# EAGLE design ot3m_bt_smd (EAGLE 7.1.0)
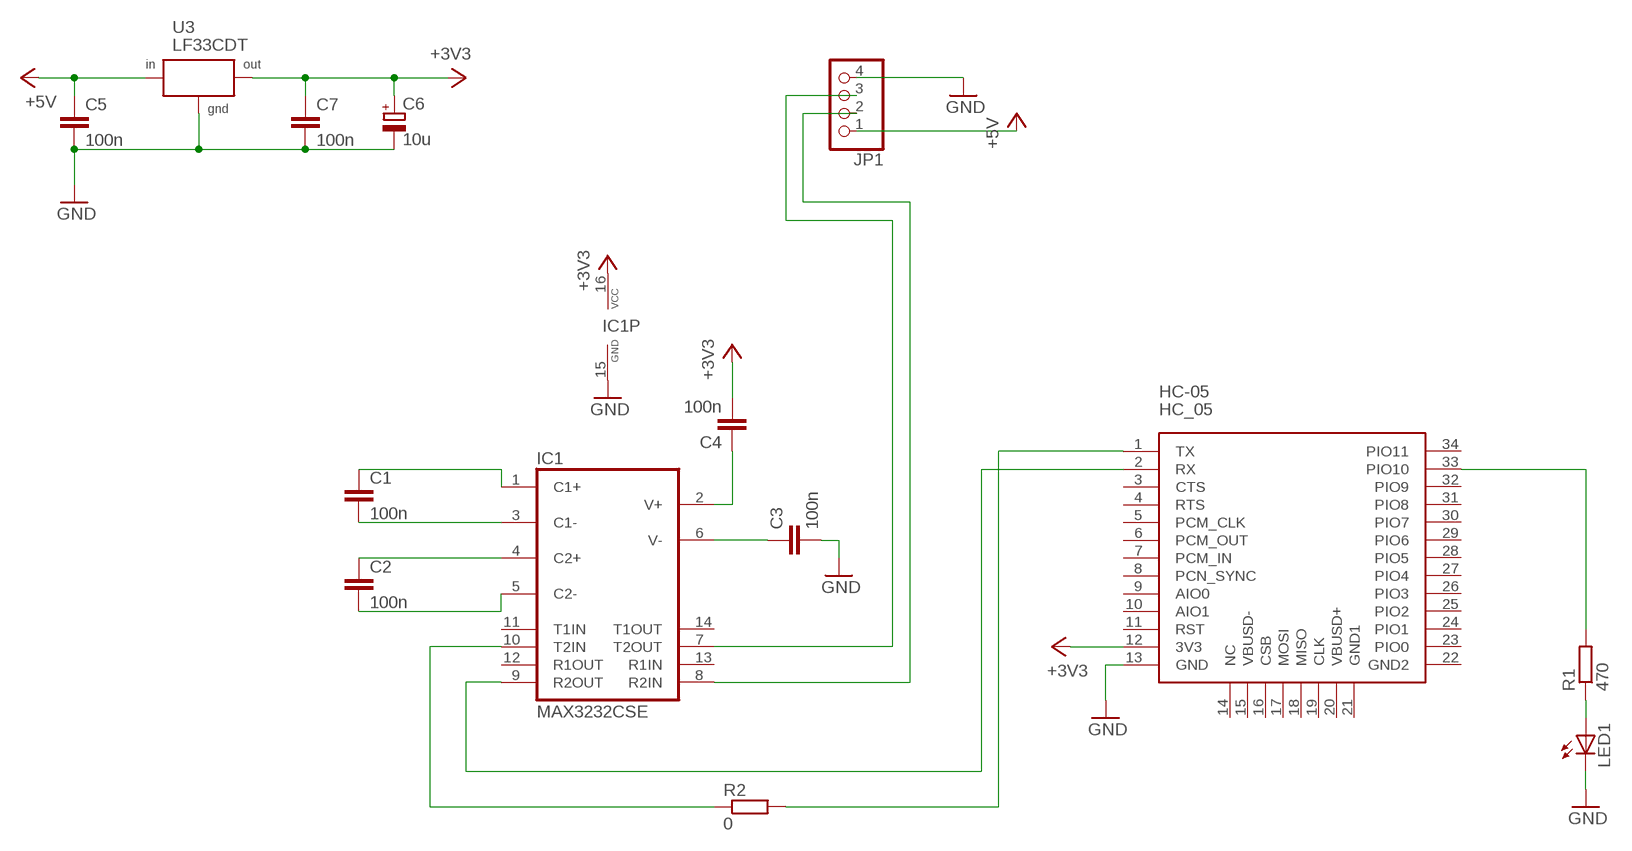
[diagram p0: schematic, sheet 1]

## Parts
C1  100n  C-EUC0805  [C0805]
C2  100n  C-EUC0805  [C0805]
C3  100n  C-EUC0805  [C0805]
C4  100n  C-EUC0805  [C0805]
C5  100n  C-EUC0805  [C0805]
C6  10u  CPOL-EUB  [PANASONIC_B]
C7  100n  C-EUC0805  [C0805]
HC-05  HC_05  [BLUETOOTH_SMD]
IC1  MAX3232CSE  [SO16]
JP1  PINHD-1X4/90  [1X04/90]
LED1  LEDCHIP-LED0805  [CHIP-LED0805]
R1  470  R-EU_M0805  [M0805]
R2  0  R-EU_M0805  [M0805]
U3  LF33CDT  LF33_TO252  [DPACK]

## Nets
+3V3: C4.2 C6.+ C7.1 HC-05.12(3V3) IC1.16(VCC) U3.3(OUT)
+5V: C5.1 JP1.1 U3.1(IN)
GND: C3.2 C5.2 C6.- C7.2 HC-05.13(GND) IC1.15(GND) JP1.4 LED1.C U3.2(GND)
N$1: C1.1 IC1.1(C1+)
N$2: C1.2 IC1.3(C1-)
N$3: C2.1 IC1.4(C2+)
N$4: C2.2 IC1.5(C2-)
N$5: C4.1 IC1.2(V+)
N$6: C3.1 IC1.6(V-)
N$7: HC-05.1(TX) R2.2
N$8: HC-05.33(PIO10) R1.2
N$9: HC-05.2(RX) IC1.9(R2OUT)
N$10: IC1.7(T2OUT) JP1.3
N$11: IC1.10(T2IN) R2.1
N$12: LED1.A R1.1
N$13: IC1.8(R2IN) JP1.2
Unconnected: HC-05.3(CTS) HC-05.4(RTS) HC-05.5(PCM_CLK) HC-05.6(PCM_OUT) HC-05.7(PCM_IN) HC-05.8(PCN_SYNC) HC-05.9(AIO0) HC-05.10(AIO1) HC-05.11(RST) HC-05.14(NC) HC-05.15(VBUSD-) HC-05.16(CSB) HC-05.17(MOSI) HC-05.18(MISO) HC-05.19(CLK) HC-05.20(VBUSD+) HC-05.21(GND1) HC-05.22(GND2) HC-05.23(PIO0) HC-05.24(PIO1) HC-05.25(PIO2) HC-05.26(PIO3) HC-05.27(PIO4) HC-05.28(PIO5) HC-05.29(PIO6) HC-05.30(PIO7) HC-05.31(PIO8) HC-05.32(PIO9) HC-05.34(PIO11) IC1.11(T1IN) IC1.12(R1OUT) IC1.13(R1IN) IC1.14(T1OUT)

## Library data of the parts
C1-C5 C7 = rcl:C-EU: CAPACITOR, European symbol
C6 = resistor:CPOL-EU: POLARIZED CAPACITOR, European symbol
HC-05 = Bluetooth HC-05:HC_05: HC-05 Bluetooth Module
IC1 = maxim:MAX3232*: True RS-232 Transceivers 3.0V to 5.5V, Low-Power up to 1Mbps, Using Four 0.1µF External Capacitors Source: http://pdfserv.maxim-ic.com/en/ds/MAX3222-MAX3241.pdf; MPN: MAX3232CSE; OC_FARNELL: 9725490; OC_NEWARK: 90C2890
JP1 = pinhead:PINHD-1X4: PIN HEADER
LED1 = led:LED: LED OSRAM: - CHIPLED LG R971, LG N971, LY N971, LG Q971, LY Q971, LO R971, LY R971 LH N974, LH R974 LS Q976, LO Q976, LY Q976 LO Q996 - Hyper CHIPLED LW Q18S LB Q993, LB Q99A, LB R99A - SideLED LS A670, LO A670, LY A670, LG A670, LP A670 LB A673, LV A673, LT A673, LW A673 LH A674 LY A675 LS A676, LA A676, LO A676, LY A676, LW A676 LS A679, LY A679, LG A679 - Hyper Micro SIDELED® LS Y876, LA Y876, LO Y876, LY Y876 LT Y87S - SmartLED LW L88C, LW L88S LB L89C, LB L89S, LG L890 LS L89K, LO L89K, LY L89K LS L896, LA L896, LO L896, LY L896 - TOPLED LS T670, LO T670, LY T670, LG T670, LP T670 LSG T670, LSP T670, LSY T670, LOP T670, LYG T670 LG T671, LOG T671, LSG T671 LB T673, LV T673, LT T673, LW T673 LH T674 LS T676, LA T676, LO T676, LY T676, LB T676, LH T676, LSB T676, LW T676 LB T67C, LV T67C, LT T67C, LS T67K, LO T67K, LY T67K, LW E67C LS E67B, LA E67B, LO E67B, LY E67B, LB E67C, LV E67C, LT E67C LW T67C LS T679, LY T679, LG T679 LS T770, LO T770, LY T770, LG T770, LP T770 LB T773, LV T773, LT T773, LW T773 LH T774 LS E675, LA E675, LY E675, LS T675 LS T776, LA T776, LO T776, LY T776, LB T776 LHGB T686 LT T68C, LB T68C - Hyper Mini TOPLED® LB M676 - Mini TOPLED Santana® LG M470 LS M47K, LO M47K, LY M47K Source: http://www.osram.convergy.de LUXEON: - LUMILED® LXK2-PW12-R00, LXK2-PW12-S00, LXK2-PW14-U00, LXK2-PW14-V00 LXK2-PM12-R00, LXK2-PM12-S00, LXK2-PM14-U00 LXK2-PE12-Q00, LXK2-PE12-R00, LXK2-PE12-S00, LXK2-PE14-T00, LXK2-PE14-U00 LXK2-PB12-K00, LXK2-PB12-L00, LXK2-PB12-M00, LXK2-PB14-N00, LXK2-PB14-P00, LXK2-PB14-Q00 LXK2-PR12-L00, LXK2-PR12-M00, LXK2-PR14-Q00, LXK2-PR14-R00 LXK2-PD12-Q00, LXK2-PD12-R00, LXK2-PD12-S00 LXK2-PH12-R00, LXK2-PH12-S00 LXK2-PL12-P00, LXK2-PL12-Q00, LXK2-PL12-R00 Source: www.luxeon.com KINGBRIGHT: KA-3528ASYC Source: www.kingbright.com
R1 R2 = rcl:R-EU_: RESISTOR, European symbol
U3 = power_stabilizators:LF33: VERY LOW DROP VOLTAGE REGULATORS WITH INHIBIT LF33 > VERY LOW DROPOUT VOLTAGE (0.45V) > VERY LOW QUIESCENT CURRENT (TYP. > 50 ?A IN OFF MODE, 500 ?A IN ON MODE) > OUTPUT CURRENT UP TO 500 mA > INTERNAL CURRENT AND THERMAL LIMIT > ONLY 2.2 ?F FOR STABILITY > AVAILABLE IN ± 1% (AB) OR ± 2% (C) SELECTION AT 25 °C > SUPPLY VOLTAGE REJECTION: 80db (TYP.) > TEMPERATURE RANGE: -40 TO 125 °C; MPN: LF33CDT-TR; OC_FARNELL: 2112623; PACKAGE: TO252; SUPPLIER: STMICROELECTRONICS

## Board
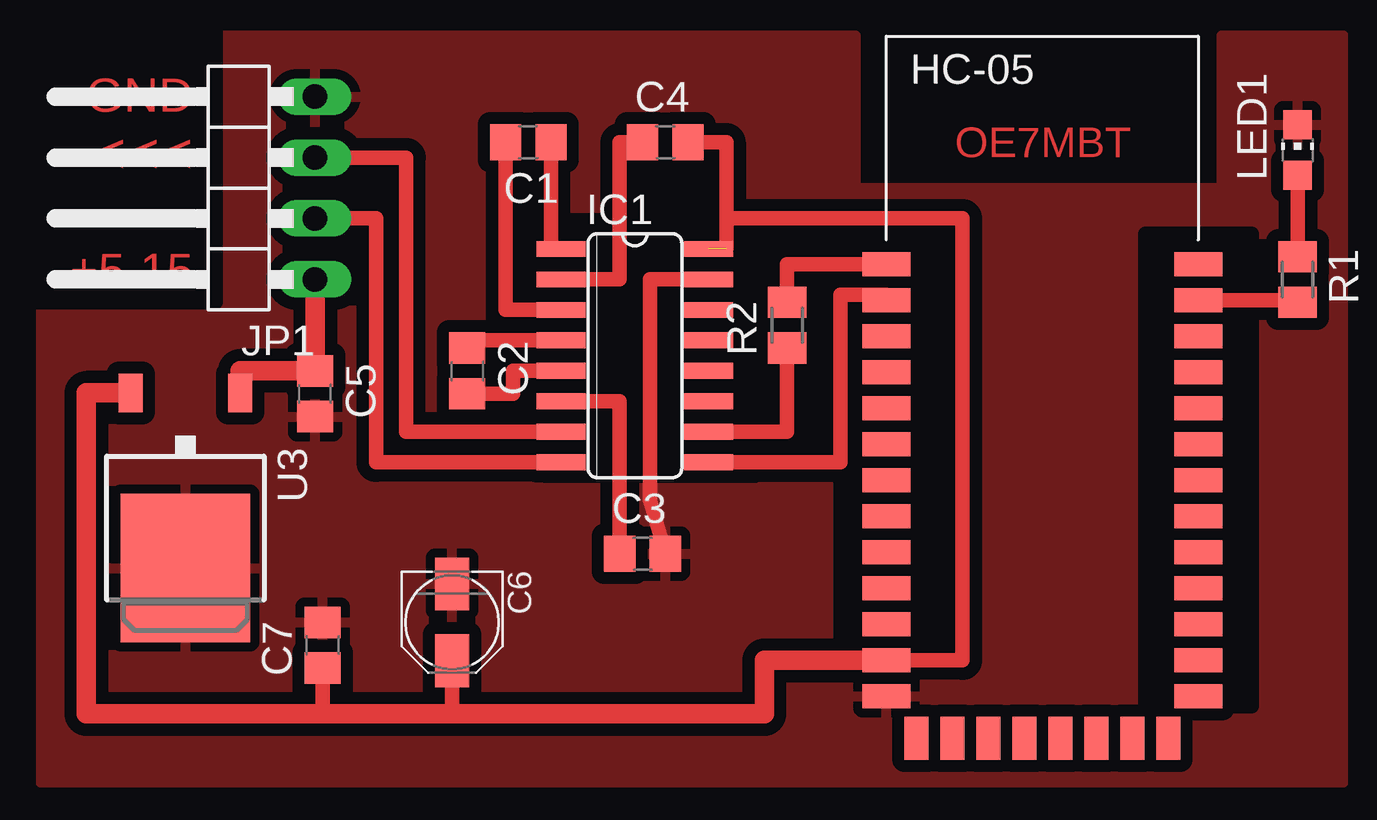
[diagram p1: board, top side]

No outline drawn. Coordinates in mm, seen from the top.
Copper layers (1*16): Top 0.035mm / dielectric 1.5mm / Bottom 0.035mm
Design rules "default *": minimum track width 10mil, minimum drill 24mil, track to track 20mil, track to pad 20mil, pad to pad 20mil, via to via 20mil, smd to smd 20mil, copper to edge 40mil, drill to drill 8mil, minimum pad ring 10mil, minimum via ring 8mil, stop-mask expansion 4mil, vias tented up to drill 0mil, thermal gap 15mil
tRestrict: area 56.8,61 to 66.4,71.8; area 82.5,51.4 to 87,71.1; area 69.8,53.3 to 73.7,61; area 36.5,68.3 to 43.8,79.4

### Footprints (pad centres in the part's own frame; a part is rotated, then mirrored left to right if it is on the bottom)
C0805 = smd 1.3 x 1.5: 1 -0.95,0; 2 0.95,0
PANASONIC_B = smd 2.2 x 1.4: + 1.6,0; - -1.6,0
BLUETOOTH_SMD = smd 2 x 1: 1 -6.35,3.81; 2 -6.35,2.31; 3 -6.35,0.81; 4 -6.35,-0.69; 5 -6.35,-2.19; 6 -6.35,-3.69; 7 -6.35,-5.19; 8 -6.35,-6.69; 9 -6.35,-8.19; 10 -6.35,-9.69; 11 -6.35,-11.19; 12 -6.35,-12.69; 13 -6.35,-14.19; 22 6.65,-14.19; 23 6.65,-12.69; 24 6.65,-11.19; 25 6.65,-9.69; 26 6.65,-8.19; 27 6.65,-6.69; 28 6.65,-5.19; 29 6.65,-3.69; 30 6.65,-2.19; 31 6.65,-0.69; 32 6.65,0.81; 33 6.65,2.31; 34 6.65,3.81 | smd 1 x 1.8: 14 -5.1,-15.94; 15 -3.6,-15.94; 16 -2.1,-15.94; 17 -0.6,-15.94; 18 0.9,-15.94; 19 2.4,-15.94; 20 3.9,-15.94; 21 5.4,-15.94
SO16 = smd 0.66 x 2.032: 1 -4.445,-3.073; 2 -3.175,-3.073; 3 -1.905,-3.073; 4 -0.635,-3.073; 5 0.635,-3.073; 6 1.905,-3.073; 7 3.175,-3.073; 8 4.445,-3.073; 9 4.445,3.073; 10 3.175,3.073; 11 1.905,3.073; 12 0.635,3.073; 13 -0.635,3.073; 14 -1.905,3.073; 15 -3.175,3.073; 16 -4.445,3.073
1X04/90 = drill 1.016 long: 1 -3.81,-3.81; 2 -1.27,-3.81; 3 1.27,-3.81; 4 3.81,-3.81
CHIP-LED0805 = smd 1.2 x 1.2: A 0,-1.05; C 0,1.05
M0805 = smd 1.3 x 1.6: 1 -0.95,0; 2 0.95,0
DPACK = smd 1 x 1.6: 1 -2.28,-4.8; 3 2.28,-4.8 | smd 5.4 x 6.2: 2 0,2.5

### Placement (x,y rotation side)
C1  56.83,74.93 180 top
C2  54.29,65.41 270 top
C3  61.59,57.78 0 top
C4  62.55,74.93 0 top
C5  47.94,64.45 270 top
C6  53.66,54.93 270 top
C7  48.26,53.98 90 top
HC-05  78.11,66.04 0 top
IC1  61.28,66.04 270 top
JP1  44.13,73.03 90 top
LED1  88.9,74.61 0 top
R1  88.9,69.22 270 top
R2  67.63,67.31 90 top
U3  42.55,59.69 180 top

### Tracks (layer width: path | path; a pad name or v marks a point on that pad's centre or on a via)
+3V3  (1 unrouted)
  Top 0.61: C7.1 48.26,51.12 | C6.+ 53.66,51.12 | C4.2 65.09,74.93 65.09,71.75 | 65.09,70.48 65.09,71.75 | 65.09,71.75 74.93,71.75 74.93,53.34 HC-05.12
  Top 0.813: U3.3 38.42,64.49 38.42,51.12 48.26,51.12 53.66,51.12 66.67,51.12 66.67,53.34 HC-05.12
+5V
  Top 0.813: JP1.1 C5.1 44.83,65.4 U3.1
GND
  Top 0.61: IC1.15 61.91,69.22 61.91,60.01 C3.2
  pour Top: 90.81,79.38 85.72,79.38 85.72,73.03 70.48,73.03 70.48,79.38 36.51,79.38 36.51,48.26 90.81,48.26
N$1
  Top 0.61: IC1.1 57.78,70.48 C1.1
N$2
  Top 0.61: IC1.3 55.88,67.94 C1.2
N$3
  Top 0.61: IC1.4 54.29,66.67 C2.1
N$4
  Top 0.61: IC1.5 56.2,65.41 56.2,64.45 C2.2
N$5
  Top 0.61: C4.1 60.64,74.93 60.64,69.22 IC1.2
N$6
  Top 0.61: IC1.6 60.65,64.14 C3.1
N$7
  Top 0.61: HC-05.1 67.63,69.85 R2.2
N$8
  Top 0.61: HC-05.33 88.9,68.35 R1.2
N$9
  Top 0.61: IC1.9 69.85,61.59 69.85,68.58 71.75,68.58 HC-05.2
N$10
  Top 0.61: IC1.7 51.75,62.87 51.75,74.3 JP1.3
N$11
  Top 0.61: R2.1 67.63,62.87 IC1.10
N$12
  Top 0.61: LED1.A R1.1
N$13
  Top 0.61: IC1.8 50.48,61.59 50.48,71.75 JP1.2

### Text on the board
Top: GND | <<< | OE7MBT | +5-15